# EAGLE design crazypi (EAGLE 9.1.1)
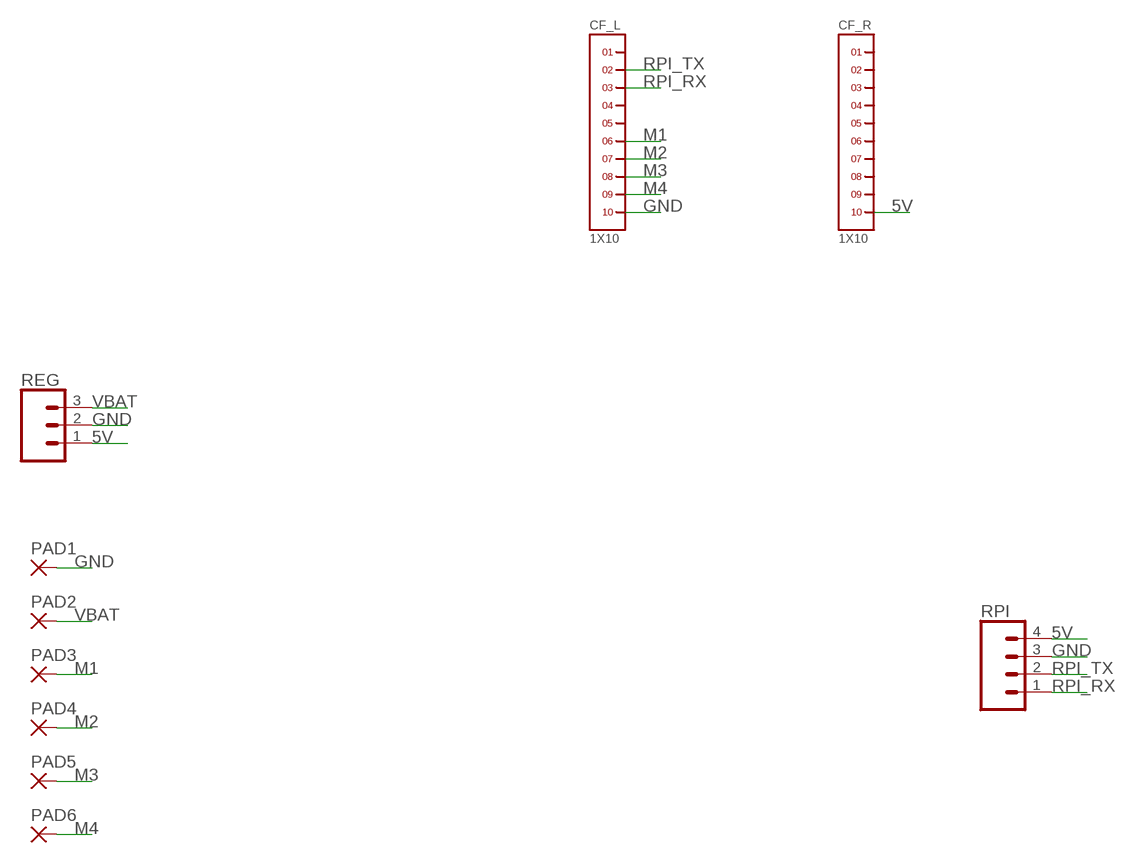
[diagram p0: schematic, sheet 1]

## Parts
CF_L  1X10  [1X10]
CF_R  1X10  [1X10]
PAD1  SMD2  [SMD1,27-2,54]
PAD2  SMD2  [SMD1,27-2,54]
PAD3  SMD2  [SMD1,27-2,54]
PAD4  SMD2  [SMD1,27-2,54]
PAD5  SMD2  [SMD1,27-2,54]
PAD6  SMD2  [SMD1,27-2,54]
REG  CONN_031X03_NO_SILK  [1X03_NO_SILK]
RPI  CONN_041X04_NO_SILK  [1X04_NO_SILK]

## Nets
5V: CF_R.10 REG.1 RPI.4
GND: CF_L.10 PAD1.1(P) REG.2 RPI.3
M1: CF_L.6 PAD3.1(P)
M2: CF_L.7 PAD4.1(P)
M3: CF_L.8 PAD5.1(P)
M4: CF_L.9 PAD6.1(P)
RPI_RX: CF_L.3 RPI.1
RPI_TX: CF_L.2 RPI.2
VBAT: PAD2.1(P) REG.3
Unconnected: CF_L.1 CF_L.4 CF_L.5 CF_R.1 CF_R.2 CF_R.3 CF_R.4 CF_R.5 CF_R.6 CF_R.7 CF_R.8 CF_R.9

## Library data of the parts
CF_L CF_R = headers(2mm):1X10
PAD1-PAD6 = wirepad:SMD2: SMD PAD
REG = SparkFun-Connectors:CONN_03: Multi connection point. Often used as Generic Header-pin footprint for 0.1 inch spaced/style header connections On any of the 0.1 inch spaced packages, you can populate with these: Break Away Headers - Straight <https://www.sparkfun.com/products/116> (PRT-00116) Break Away Male Headers - Right Angle <https://www.sparkfun.com/products/553> (PRT-00553) Female Headers <https://www.sparkfun.com/products/115> (PRT-00115) Break Away Headers - Machine Pin <https://www.sparkfun.com/products/117> (PRT-00117) Break Away Female Headers - Swiss Machine Pin <https://www.sparkfun.com/products/743> (PRT-00743) Stackable Header - 3 Pin (Female, 0.1") <https://www.sparkfun.com/products/13875> (PRT-13875) For SCREWTERMINALS and SPRING TERMINALS visit here: Screw Terimnals on SparkFun.com <https://www.sparkfun.com/search/results?term=Screw+Terminals> (5mm/3.5mm/2.54mm spacing) This device is also useful as a general connection point to wire up your design to another part of your project. Our various solder wires solder well into these plated through hole pads. Hook-Up Wire - Assortment (Stranded, 22 AWG) <https://www.sparkfun.com/products/11375> (PRT-11375) Hook-Up Wire - Assortment (Solid Core, 22 AWG) <https://www.sparkfun.com/products/11367> (PRT-11367) View the entire wire category on our website here <https://www.sparkfun.com/categories/141> Special notes: Molex polarized connector foot print use with SKU : PRT-08232 with associated crimp pins and housings.
RPI = SparkFun-Connectors:CONN_04: Multi connection point. Often used as Generic Header-pin footprint for 0.1 inch spaced/style header connections On any of the 0.1 inch spaced packages, you can populate with these: Break Away Headers - Straight <https://www.sparkfun.com/products/116> (PRT-00116) Break Away Male Headers - Right Angle <https://www.sparkfun.com/products/553> (PRT-00553) Female Headers <https://www.sparkfun.com/products/115> (PRT-00115) Break Away Headers - Machine Pin <https://www.sparkfun.com/products/117> (PRT-00117) Break Away Female Headers - Swiss Machine Pin <https://www.sparkfun.com/products/743> (PRT-00743) For SCREWTERMINALS and SPRING TERMINALS visit here: Screw Terimnals on SparkFun.com <https://www.sparkfun.com/search/results?term=Screw+Terminals> (5mm/3.5mm/2.54mm spacing) This device is also useful as a general connection point to wire up your design to another part of your project. Our various solder wires solder well into these plated through hole pads. Hook-Up Wire - Assortment (Stranded, 22 AWG) <https://www.sparkfun.com/products/11375> (PRT-11375) Hook-Up Wire - Assortment (Solid Core, 22 AWG) <https://www.sparkfun.com/products/11367> (PRT-11367) View the entire wire category on our website here <https://www.sparkfun.com/categories/141> Special notes: Molex polarized connector foot print use with SKU : PRT-08231 with associated crimp pins and housings. 1MM SMD Version SKU: PRT-10208; PROD_ID: CONN-09696

## Board
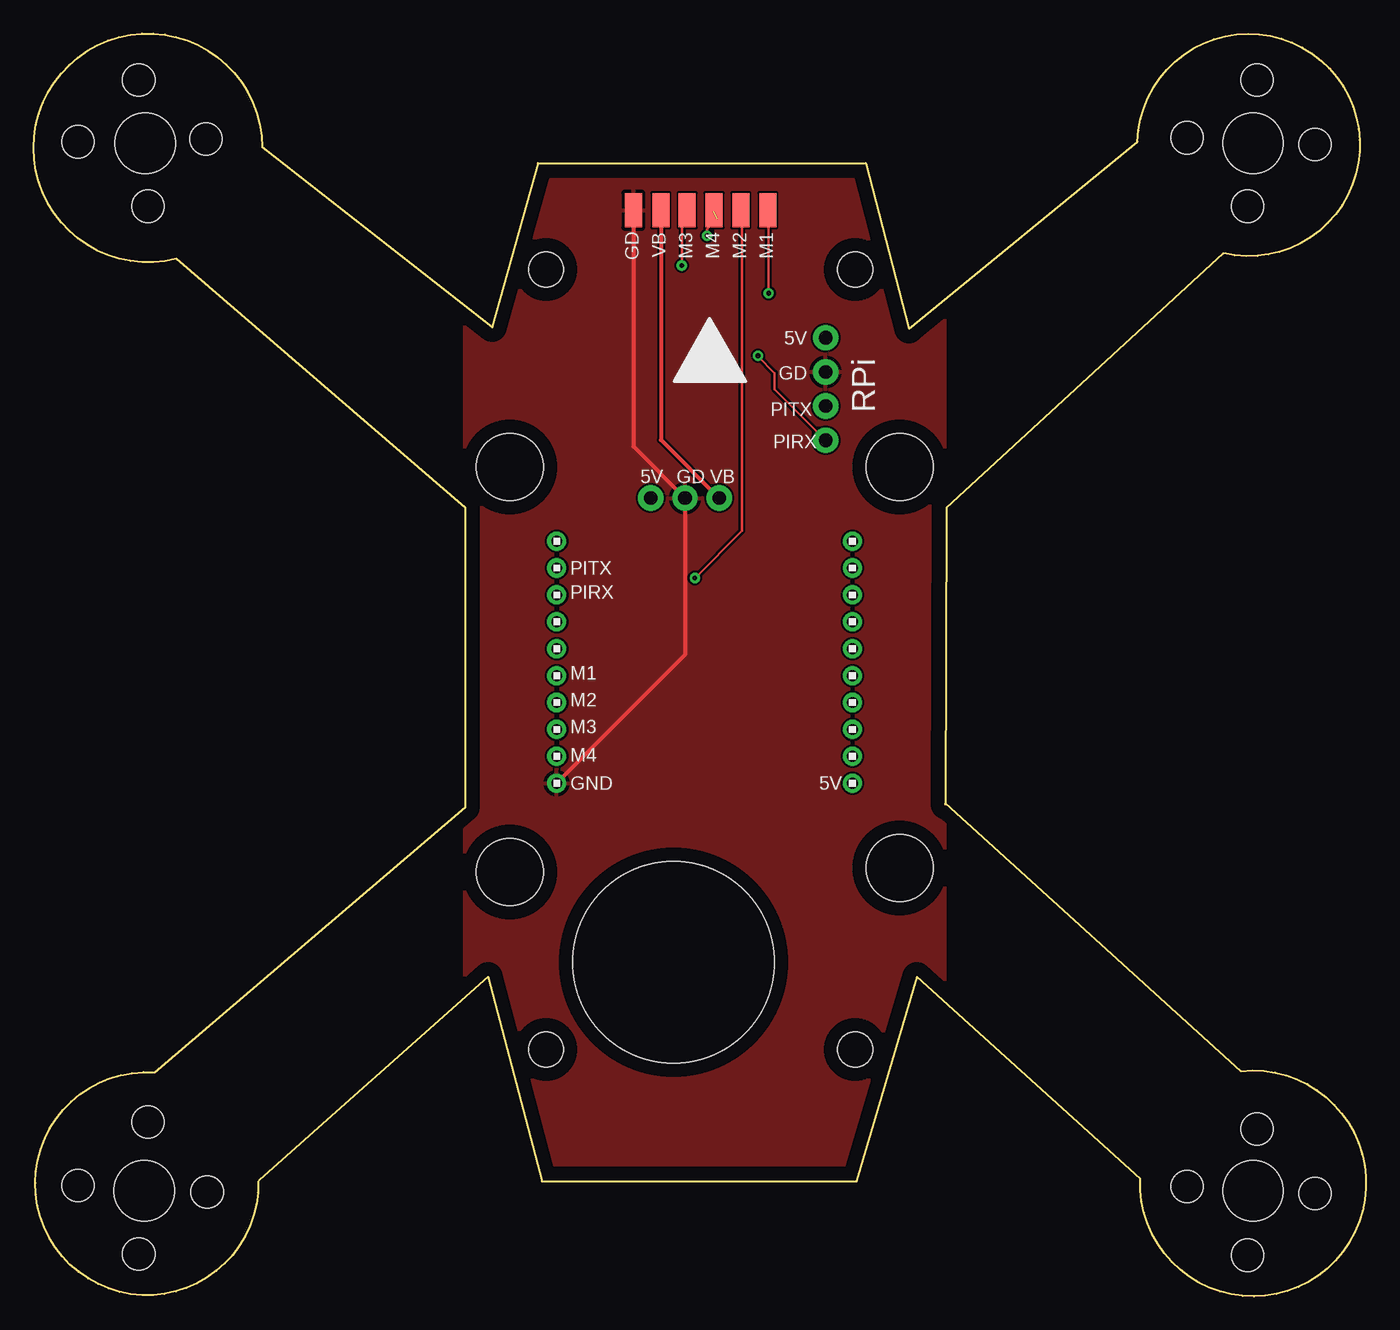
[diagram p1: board, top side]
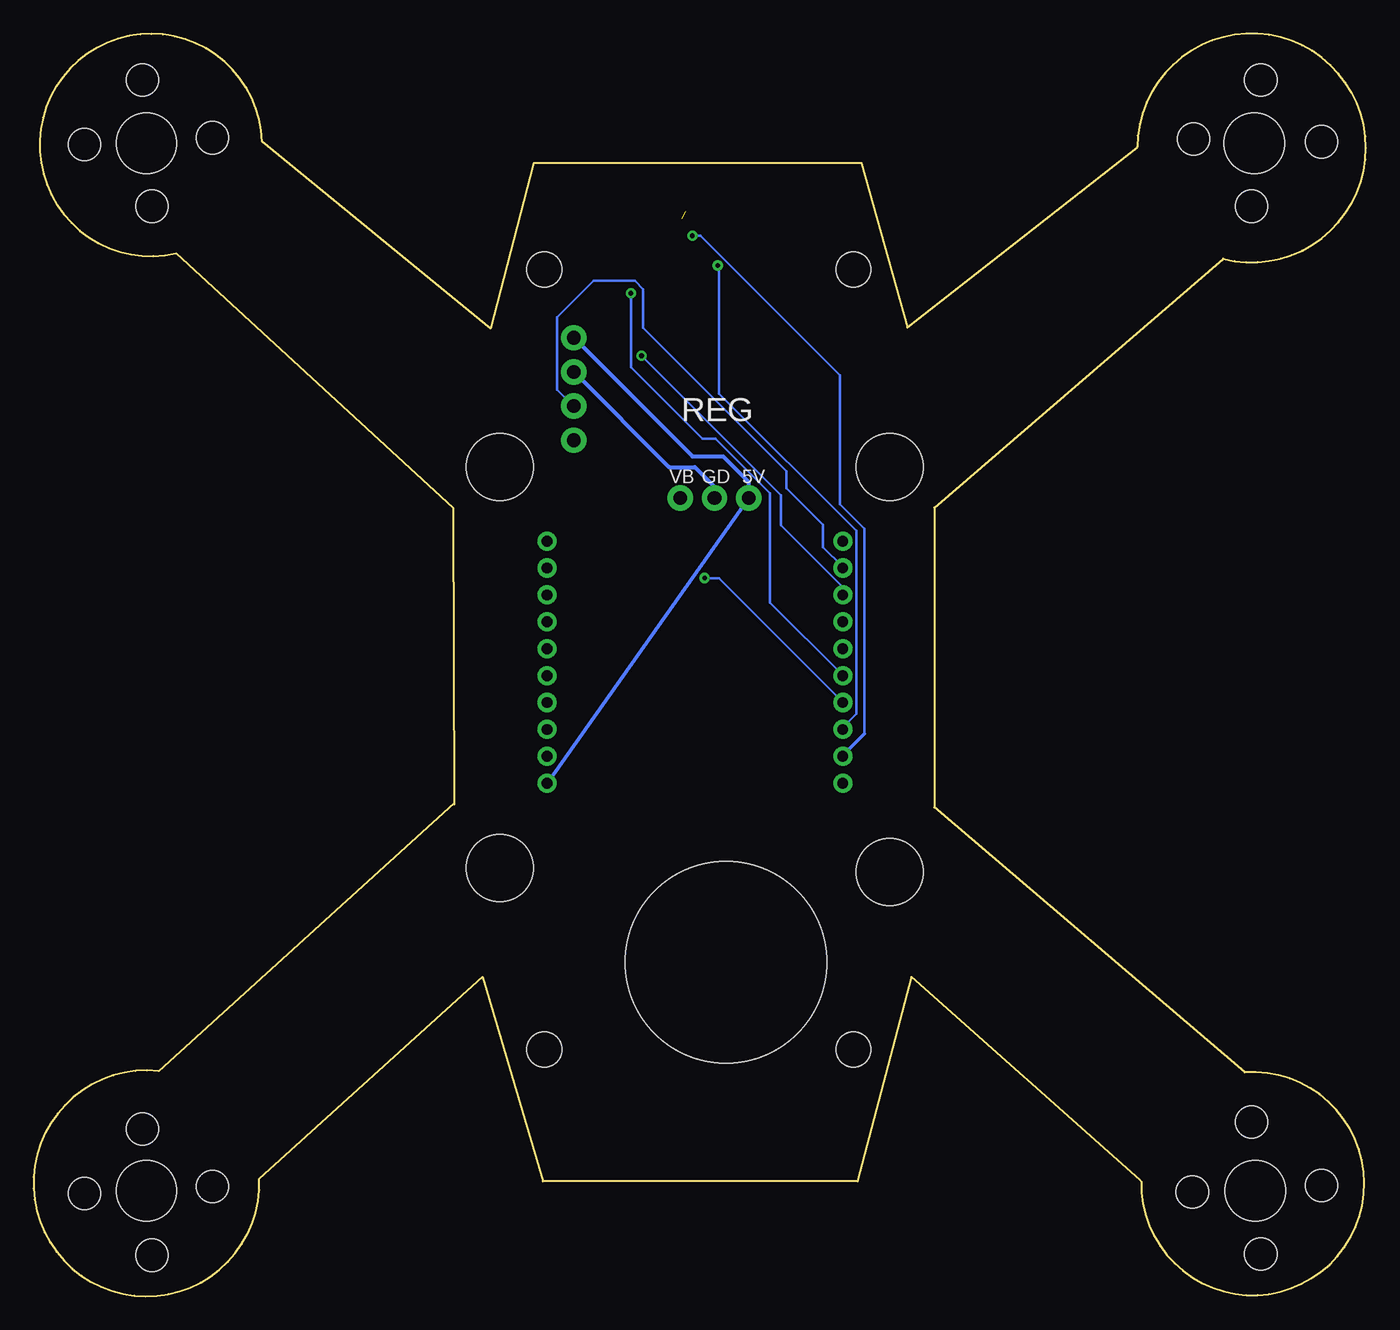
[diagram p2: board, bottom side, seen from below]

Size 99.1 x 93.9 mm. Coordinates in mm from the lower left corner, seen from the top.
Outline: 67.81,36.56 67.91,58.66 88.51,77.56 arc281 82.11,85.86 65.11,71.96 61.91,84.26 37.51,84.26 34.11,72.06 17.01,85.46 arc284 10.61,77.16 32.11,58.66 32.11,36.36 9.01,16.66 arc275 16.71,8.56
Outline: 16.81,8.66 33.81,23.76 37.81,8.56 61.21,8.56 65.71,23.76 82.31,8.76 arc279 89.81,16.76 67.81,36.66
Copper layers (1*16): Top 0.035mm / dielectric 1.5mm / Bottom 0.035mm
Design rules "default": minimum track width 6mil, minimum drill 0.35mm, track to track 6mil, track to pad 6mil, pad to pad 6mil, via to via 6mil, smd to smd 6mil, copper to edge 40mil, drill to drill 6mil, minimum pad ring 10mil, minimum via ring 8mil, stop-mask expansion 4mil, vias tented up to drill 0mil, thermal gap 10mil
Holes 4.5 mm at 90.71,85.76 8.21,7.86 8.31,85.76 90.71,7.86
Holes 2.4 mm at 91.01,90.46 90.31,81.06 85.81,86.16 95.31,85.66 7.81,90.46 8.51,81.06 3.31,85.86 12.81,86.06 91.01,12.46 90.31,3.06 85.81,8.16 95.31,7.66 8.51,12.96 7.81,3.16 3.31,8.26 12.91,7.76
Holes 5 mm at 35.41,61.66 64.41,61.66 64.41,31.86 35.41,31.56
Holes 2.6 mm at 38.11,76.36 61.11,76.36 38.11,18.36 61.11,18.36
Holes 15 mm at 47.61,24.86

### Footprints (pad centres in the part's own frame; a part is rotated, then mirrored left to right if it is on the bottom)
1X10 = drill 0.8 pad 1.422: 1 -9,0; 2 -7,0; 3 -5,0; 4 -3,0; 5 -1,0; 6 1,0; 7 3,0; 8 5,0; 9 7,0; 10 9,0
SMD1,27-2,54 = smd 1.27 x 2.54: 1 0,0
1X03_NO_SILK = drill 1.016 pad 1.88: 1 0,0; 2 2.54,0; 3 5.08,0
1X04_NO_SILK = drill 1.016 pad 1.88: 1 0,0; 2 2.54,0; 3 5.08,0; 4 7.62,0

### Placement (x,y rotation side)
CF_L  38.91,47.16 270 top
CF_R  60.91,47.16 270 top
PAD1  44.61,80.76 0 top
PAD2  46.66,80.76 0 top
PAD3  54.61,80.76 0 top
PAD4  52.61,80.76 0 top
PAD5  48.61,80.76 0 top
PAD6  50.61,80.76 0 top
REG  45.91,59.36 0 top
RPI  58.91,63.66 90 top

### Tracks (layer width: path | path; a pad name or v marks a point on that pad's centre or on a via)
5V
  Bottom 0.305: RPI.4 50.09,62.46 47.81,62.46 45.91,60.56 REG.1 CF_R.10
GND
  Top 0.305: PAD1.1 44.61,63.2 REG.2 48.45,47.7 CF_L.10
  Bottom 0.305: RPI.3 51.83,61.66 49.91,61.66 48.45,60.2 REG.2
  pour Top: 67.76,91.11 67.76,7.11 32.11,7.11 32.11,91.11
M1  (via drill 0.35)
  Top 0.152: 54.67,80.69 PAD3.1
  Top 0.203: v54.67,74.6 54.67,80.69
  Bottom 0.152: 38.98,46.25 CF_L.6
  Bottom 0.203: v54.67,74.6 54.67,69.09 49.35,63.76 48.36,63.76 44.31,59.71 44.31,51.58 38.98,46.25
M2  (via drill 0.35)
  Top 0.152: 52.69,80.54 PAD4.1
  Top 0.203: 52.69,80.54 52.69,56.92 v49.19,53.41
  Top 0.305: PAD4.1 52.71,80.66
  Bottom 0.152: 38.98,44.27 CF_L.7
  Bottom 0.203: v49.19,53.41 48.12,53.41 38.98,44.27
M3  (via drill 0.35)
  Top 0.203: 48.21,80.36 v48.21,76.66
  Top 0.305: PAD5.1 48.21,80.36
  Bottom 0.152: 38.82,42.29 CF_L.8
  Bottom 0.203: 38.82,42.29 38.82,42.4 37.91,43.31 37.91,56.91 48.12,67.12 48.12,76.58 v48.21,76.66
M4  (via drill 0.35)  (1 unrouted)
  Top 0.152: 50.56,80.69 PAD6.1
  Top 0.203: 50.86,80.12 50.1,79.36 v50.1,78.86
  Bottom 0.152: 38.82,40.31 CF_L.9
  Bottom 0.203: v50.1,78.86 49.49,78.86 39.13,68.5 39.13,58.89 37.3,57.06 37.3,41.82
  Bottom 0.254: 38.82,40.31 37.3,41.82
RPI_RX  (via drill 0.35)
  Top 0.203: RPI.1 55.11,67.46 55.11,68.66 53.88,69.89 v53.88,69.94
  Bottom 0.152: 38.98,52.8 38.98,52.19 CF_L.3
  Bottom 0.203: 38.98,52.8 43.51,57.33 43.51,59.56 v53.88,69.94
RPI_TX
  Bottom 0.152: 58.94,66.21 RPI.2
  Bottom 0.2: 53.76,74.9 53.76,72.01
  Bottom 0.203: 53.76,72.01 43.1,61.35 43.1,60.11 40.38,57.38 40.38,55.72 38.91,54.26 CF_L.2 | 53.76,74.9 54.37,75.51 57.45,75.51 60.16,72.8 60.16,67.43 58.94,66.21
VBAT
  Top 0.305: PAD2.1 46.66,63.69 REG.3

### Text on the board
tNames: GD | VB | M3 | M4 | M2 | M1 | 5V | GD | RPi | PITX | PIRX | 5V | GD | VB | PITX | PIRX | M1 | M2 | M3 | M4 | GND | 5V
bNames: REG | 5V | GD | VB